# EAGLE design Zumo-Feather-1.0 (EAGLE 9.6.2)
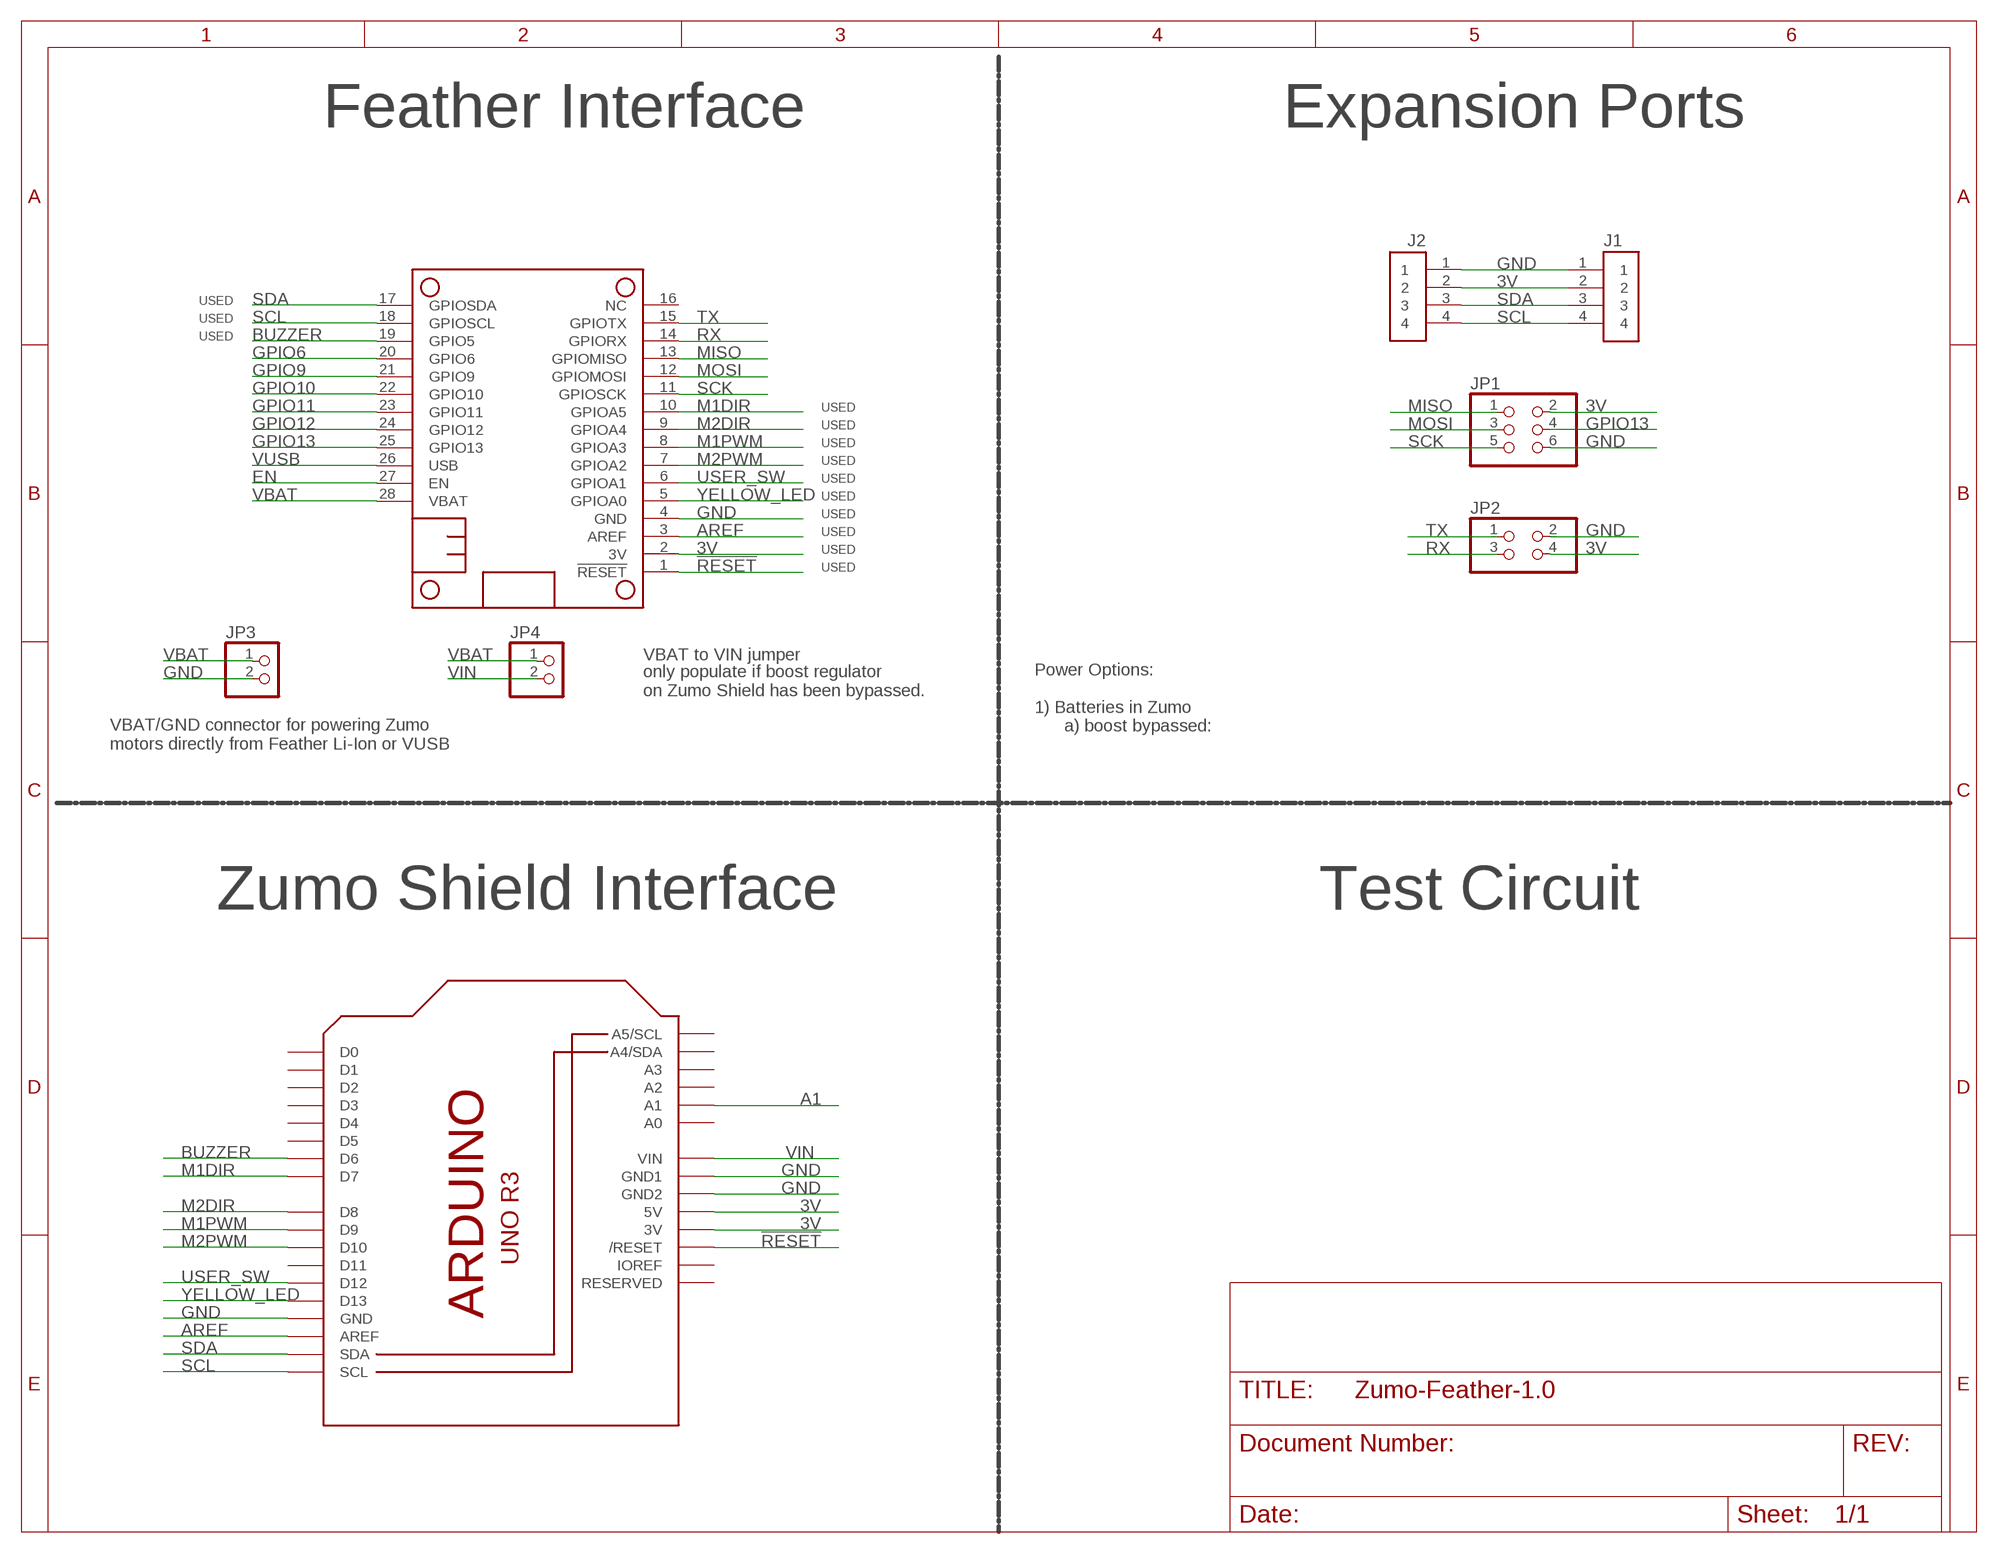
[diagram p0: schematic, sheet 1]

## Parts
J1  CON-SM04B-SRSS-TB  [JST_SH_4X1]
J2  CON-SM04B-SRSS-TB  [JST_SH_4X1]
JP1  PINHD-2X3  [2X03]
JP2  PINHD-2X2  [2X02]
JP3  PINHD-1X2  [1X02]
JP4  PINHD-1X2  [1X02]
MS1  BRD-FEATHERWING_NODIM_NOMNT  [FEATHERWING_DIM_MNT]
U1  BRD-ARDUINOR3-DIMENSION  [ARDUINOR3]

## Nets
3V: J1.2 J2.2 JP1.2 JP2.4 MS1.2(3V) U1.3V U1.5V
!RESET: MS1.1(!RESET) U1.RESET(/RESET)
A1: U1.A1
AREF: MS1.3(AREF) U1.AREF
BUZZER: MS1.19(GPIO5) U1.D6
EN: MS1.27(EN)
GND: J1.1 J2.1 JP1.6 JP2.2 JP3.2 MS1.4(GND) U1.GND U1.GND1 U1.GND2
GPIO6: MS1.20(GPIO6)
GPIO9: MS1.21(GPIO9)
GPIO10: MS1.22(GPIO10)
GPIO11: MS1.23(GPIO11)
GPIO12: MS1.24(GPIO12)
GPIO13: JP1.4 MS1.25(GPIO13)
M1DIR: MS1.10(GPIOA5) U1.D7
M1PWM: MS1.8(GPIOA3) U1.D9
M2DIR: MS1.9(GPIOA4) U1.D8
M2PWM: MS1.7(GPIOA2) U1.D10
MISO: JP1.1 MS1.13(GPIOMISO)
MOSI: JP1.3 MS1.12(GPIOMOSI)
RX: JP2.3 MS1.14(GPIORX)
SCK: JP1.5 MS1.11(GPIOSCK)
SCL: J1.4 J2.4 MS1.18(GPIOSCL) U1.SCL
SDA: J1.3 J2.3 MS1.17(GPIOSDA) U1.SDA
TX: JP2.1 MS1.15(GPIOTX)
USER_SW: MS1.6(GPIOA1) U1.D12
VBAT: JP3.1 JP4.1 MS1.28(VBAT)
VIN: JP4.2 U1.VIN
VUSB: MS1.26(USB)
YELLOW_LED: MS1.5(GPIOA0) U1.D13
Unconnected: MS1.16(NC) U1.A0 U1.A2 U1.A3 U1.A4(A4/SDA) U1.A5(A5/SCL) U1.D0 U1.D1 U1.D2 U1.D3 U1.D4 U1.D5 U1.D11 U1.IOREF U1.RESERVED

## Notes on the sheet
- Feather Interface | Expansion Ports
- USED
- USED
- USED
- USED
- USED
- USED
- USED
- USED
- USED
- USED
- USED
- USED
- USED
- VBAT to VIN jumper
- only populate if boost regulator 
  on Zumo Shield has been bypassed.
- Power Options:
  
  1) Batteries in Zumo 
        a) boost bypassed:
- VBAT/GND connector for powering Zumo
  motors directly from Feather Li-Ion or VUSB
- Zumo Shield Interface | Test Circuit

## Library data of the parts
J1 J2 = AIMRL:CON-SM04B-SRSS-TB: CONN HEADER SH 4POS SIDE 1MM TIN; ARROW_PN: SM04B-SRSS-TB; DATASHEET: https://media.digikey.com/pdf/Data%20Sheets/JST%20PDFs/SR%20Connector.pdf; DESCRIPTION: CONN HEADER SMD R/A 4POS 1MM; DIGI-KEY_PN: 455-1422-2-ND; MANUFACTURER: JST Sales America Inc.; MOUSER_PN: SM04B-SRSS-TB; PACKAGE: NA; PART_NUMBER: SM04B-SRSS-TB; TEMP_HIGH: 85; TEMP_LOW: -25C; TOLERANCE: NA; TYPE: SMD; WEIGHT_MG: NA
JP1 = pinhead:PINHD-2X3: PIN HEADER
JP2 = pinhead:PINHD-2X2: PIN HEADER
JP3 JP4 = pinhead:PINHD-1X2: PIN HEADER
MS1 = AIMRL:BRD-FEATHERWING
U1 = AIMRL:BRD-ARDUINOR3: This is a new object for the new Arduino R3 - with extra pins that you may want to use (such as IOref, and duplicated A4/A5

## Board
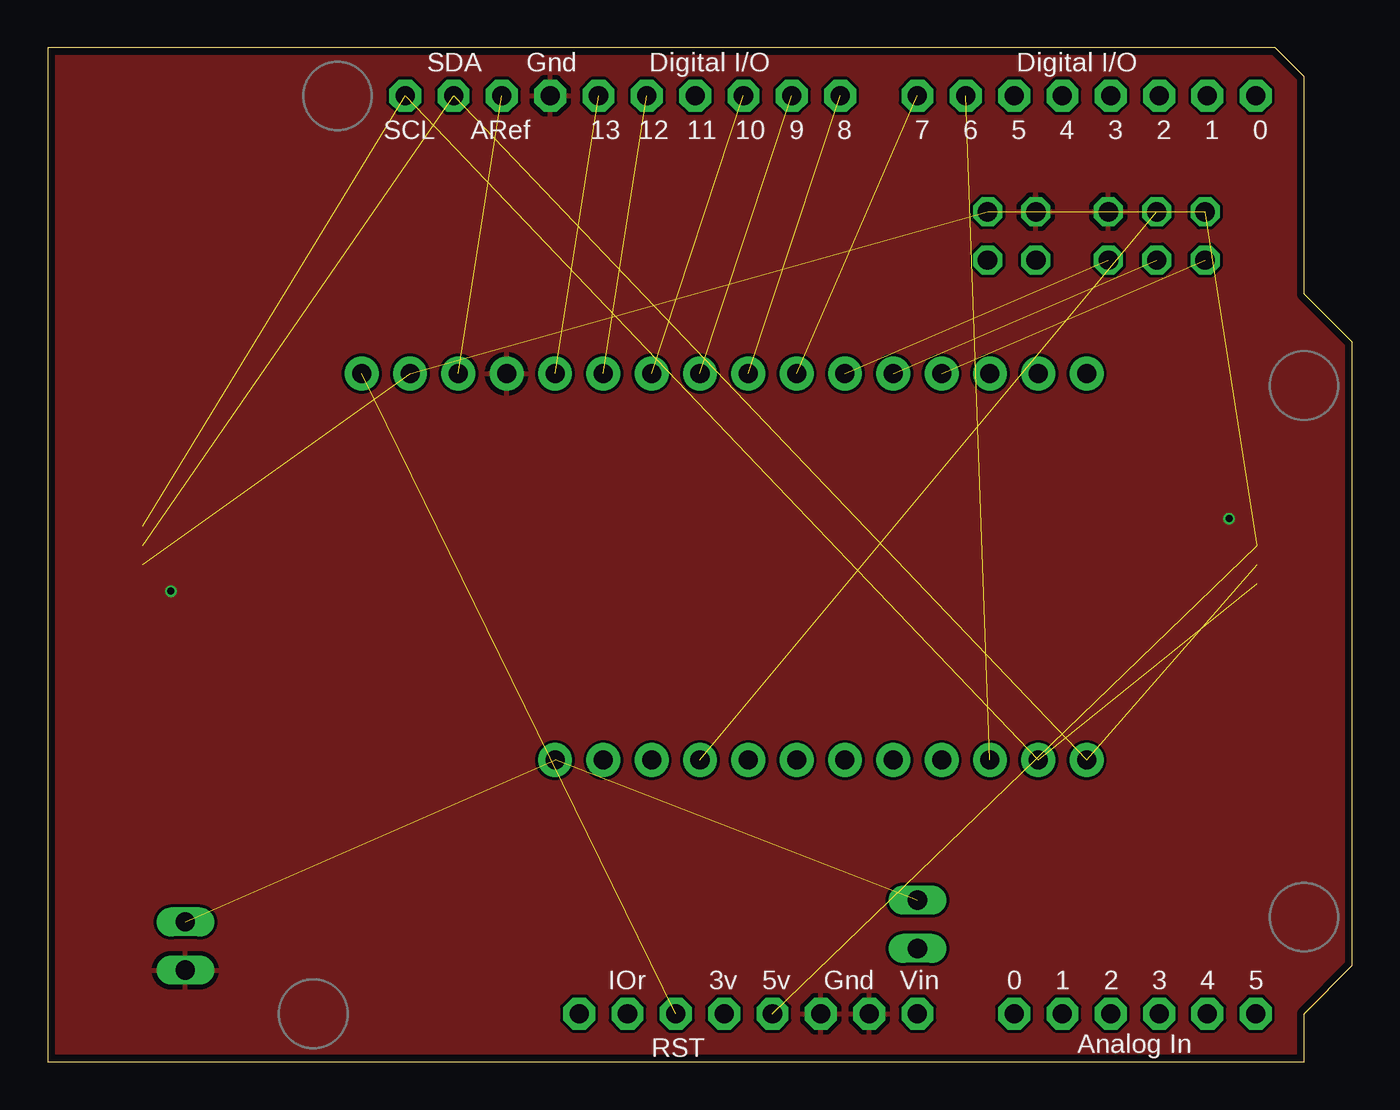
[diagram p1: board, top side]
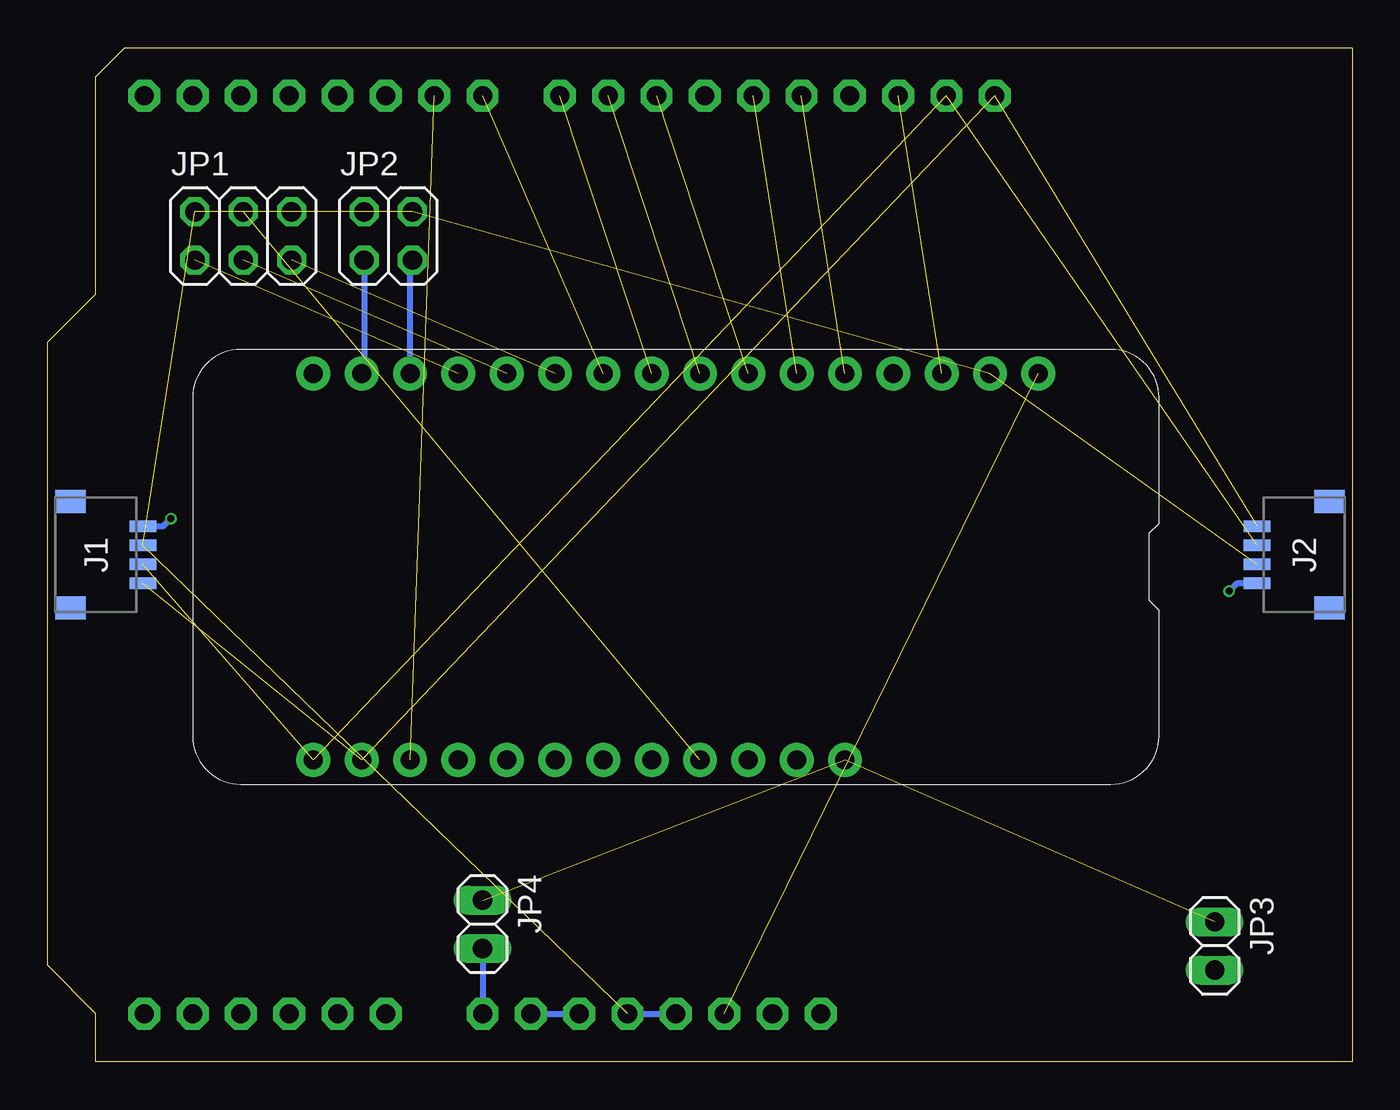
[diagram p2: board, bottom side, seen from below]

Size 68.58 x 53.34 mm. Coordinates in mm from the lower left corner, seen from the top.
Copper layers (1*16): Top 0.035559375mm / dielectric 1.6mm / Bottom 0.035559375mm
Design rules "oshpark-2layer": minimum track width 6mil, minimum drill 10mil, track to track 6mil, track to pad 6mil, pad to pad 6mil, via to via 6mil, smd to smd 6mil, copper to edge 15mil, drill to drill 6mil, minimum pad ring 5mil, minimum via ring 5mil, stop-mask expansion 2.5mil, vias tented up to drill 0mil, thermal gap 10mil

### Footprints (pad centres in the part's own frame; a part is rotated, then mirrored left to right if it is on the bottom)
JST_SH_4X1 = smd 0.6 x 1.4: 1 -1.5,2.475; 2 -0.5,2.475; 3 0.5,2.475; 4 1.5,2.475 | smd 1.2 x 1.6: PAD1 -2.8,-1.325; PAD2 2.8,-1.325
2X03 = drill 1.016 octagon: 1 -2.54,-1.27; 2 -2.54,1.27; 3 0,-1.27; 4 0,1.27; 5 2.54,-1.27; 6 2.54,1.27
2X02 = drill 1.016 octagon: 1 -1.27,-1.27; 2 -1.27,1.27; 3 1.27,-1.27; 4 1.27,1.27
1X02 = drill 1.016 long: 1 -1.27,0; 2 1.27,0
FEATHERWING_DIM_MNT = drill 1 pad 1.778: 1 6.35,1.27; 2 8.89,1.27; 3 11.43,1.27; 4 13.97,1.27; 5 16.51,1.27; 6 19.05,1.27; 7 21.59,1.27; 8 24.13,1.27; 9 26.67,1.27; 10 29.21,1.27; 11 31.75,1.27; 12 34.29,1.27; 13 36.83,1.27; 14 39.37,1.27; 15 41.91,1.27; 16 44.45,1.27; 17 44.45,21.59; 18 41.91,21.59; 19 39.37,21.59; 20 36.83,21.59; 21 34.29,21.59; 22 31.75,21.59; 23 29.21,21.59; 24 26.67,21.59; 25 24.13,21.59; 26 21.59,21.59; 27 19.05,21.59; 28 16.51,21.59
ARDUINOR3 = drill 1 pad 1.676 octagon: 3V 35.56,2.54; 5V 38.1,2.54; A0 50.8,2.54; A1 53.34,2.54; A2 55.88,2.54; A3 58.42,2.54; A4 60.96,2.54; A5 63.5,2.54; AREF 23.876,50.8; D0 63.5,50.8; D1 60.96,50.8; D2 58.42,50.8; D3 55.88,50.8; D4 53.34,50.8; D5 50.8,50.8; D6 48.26,50.8; D7 45.72,50.8; D8 41.656,50.8; D9 39.116,50.8; D10 36.576,50.8; D11 34.036,50.8; D12 31.496,50.8; D13 28.956,50.8; GND 26.416,50.8; GND1 43.18,2.54; GND2 40.64,2.54; IOREF 30.48,2.54; RESERVED 27.94,2.54; RESET 33.02,2.54; SCL 18.796,50.8; SDA 21.336,50.8; VIN 45.72,2.54

### Placement (x,y rotation side)
J1  66.04,26.67 270 bottom
J2  2.54,26.67 90 bottom
JP1  58.29,43.43 0 bottom
JP2  50.67,43.43 0 bottom
JP3  7.24,6.1 270 bottom
JP4  45.72,7.24 270 bottom
MS1  10.16,37.47 180 bottom
U1  0,0 0 top

### Tracks (layer width: path | path; a pad name or v marks a point on that pad's centre or on a via)
3V  (5 unrouted)
  Bottom 0.305: U1.5V U1.3V
!RESET  (1 unrouted)
AREF  (1 unrouted)
BUZZER  (1 unrouted)
GND  (via drill 0.35)
  Bottom 0.305: J2.1 6.07,25.17 v6.48,24.77 | J1.1 62.51,28.17 v62.1,28.57 | U1.GND1 U1.GND2
  pour Top: 0,53.34 0,0 66.04,0 66.04,2.54 68.58,5.08 68.58,5.71 68.58,37.47 68.58,37.85 66.04,40.39 66.04,51.82 64.52,53.34 64.26,53.34
GPIO13  (1 unrouted)
M1DIR  (1 unrouted)
M1PWM  (1 unrouted)
M2DIR  (1 unrouted)
M2PWM  (1 unrouted)
MISO  (1 unrouted)
MOSI  (1 unrouted)
RX
  Bottom 0.305: MS1.14 49.53,42.04 JP2.3
SCK  (1 unrouted)
SCL  (3 unrouted)
SDA  (3 unrouted)
TX
  Bottom 0.305: JP2.1 51.94,36.32 MS1.15
USER_SW  (1 unrouted)
VBAT  (2 unrouted)
VIN
  Bottom 0.305: JP4.2 U1.VIN
YELLOW_LED  (1 unrouted)